# EAGLE schematic Wave X Motor Drivers (EAGLE 7.3.0)
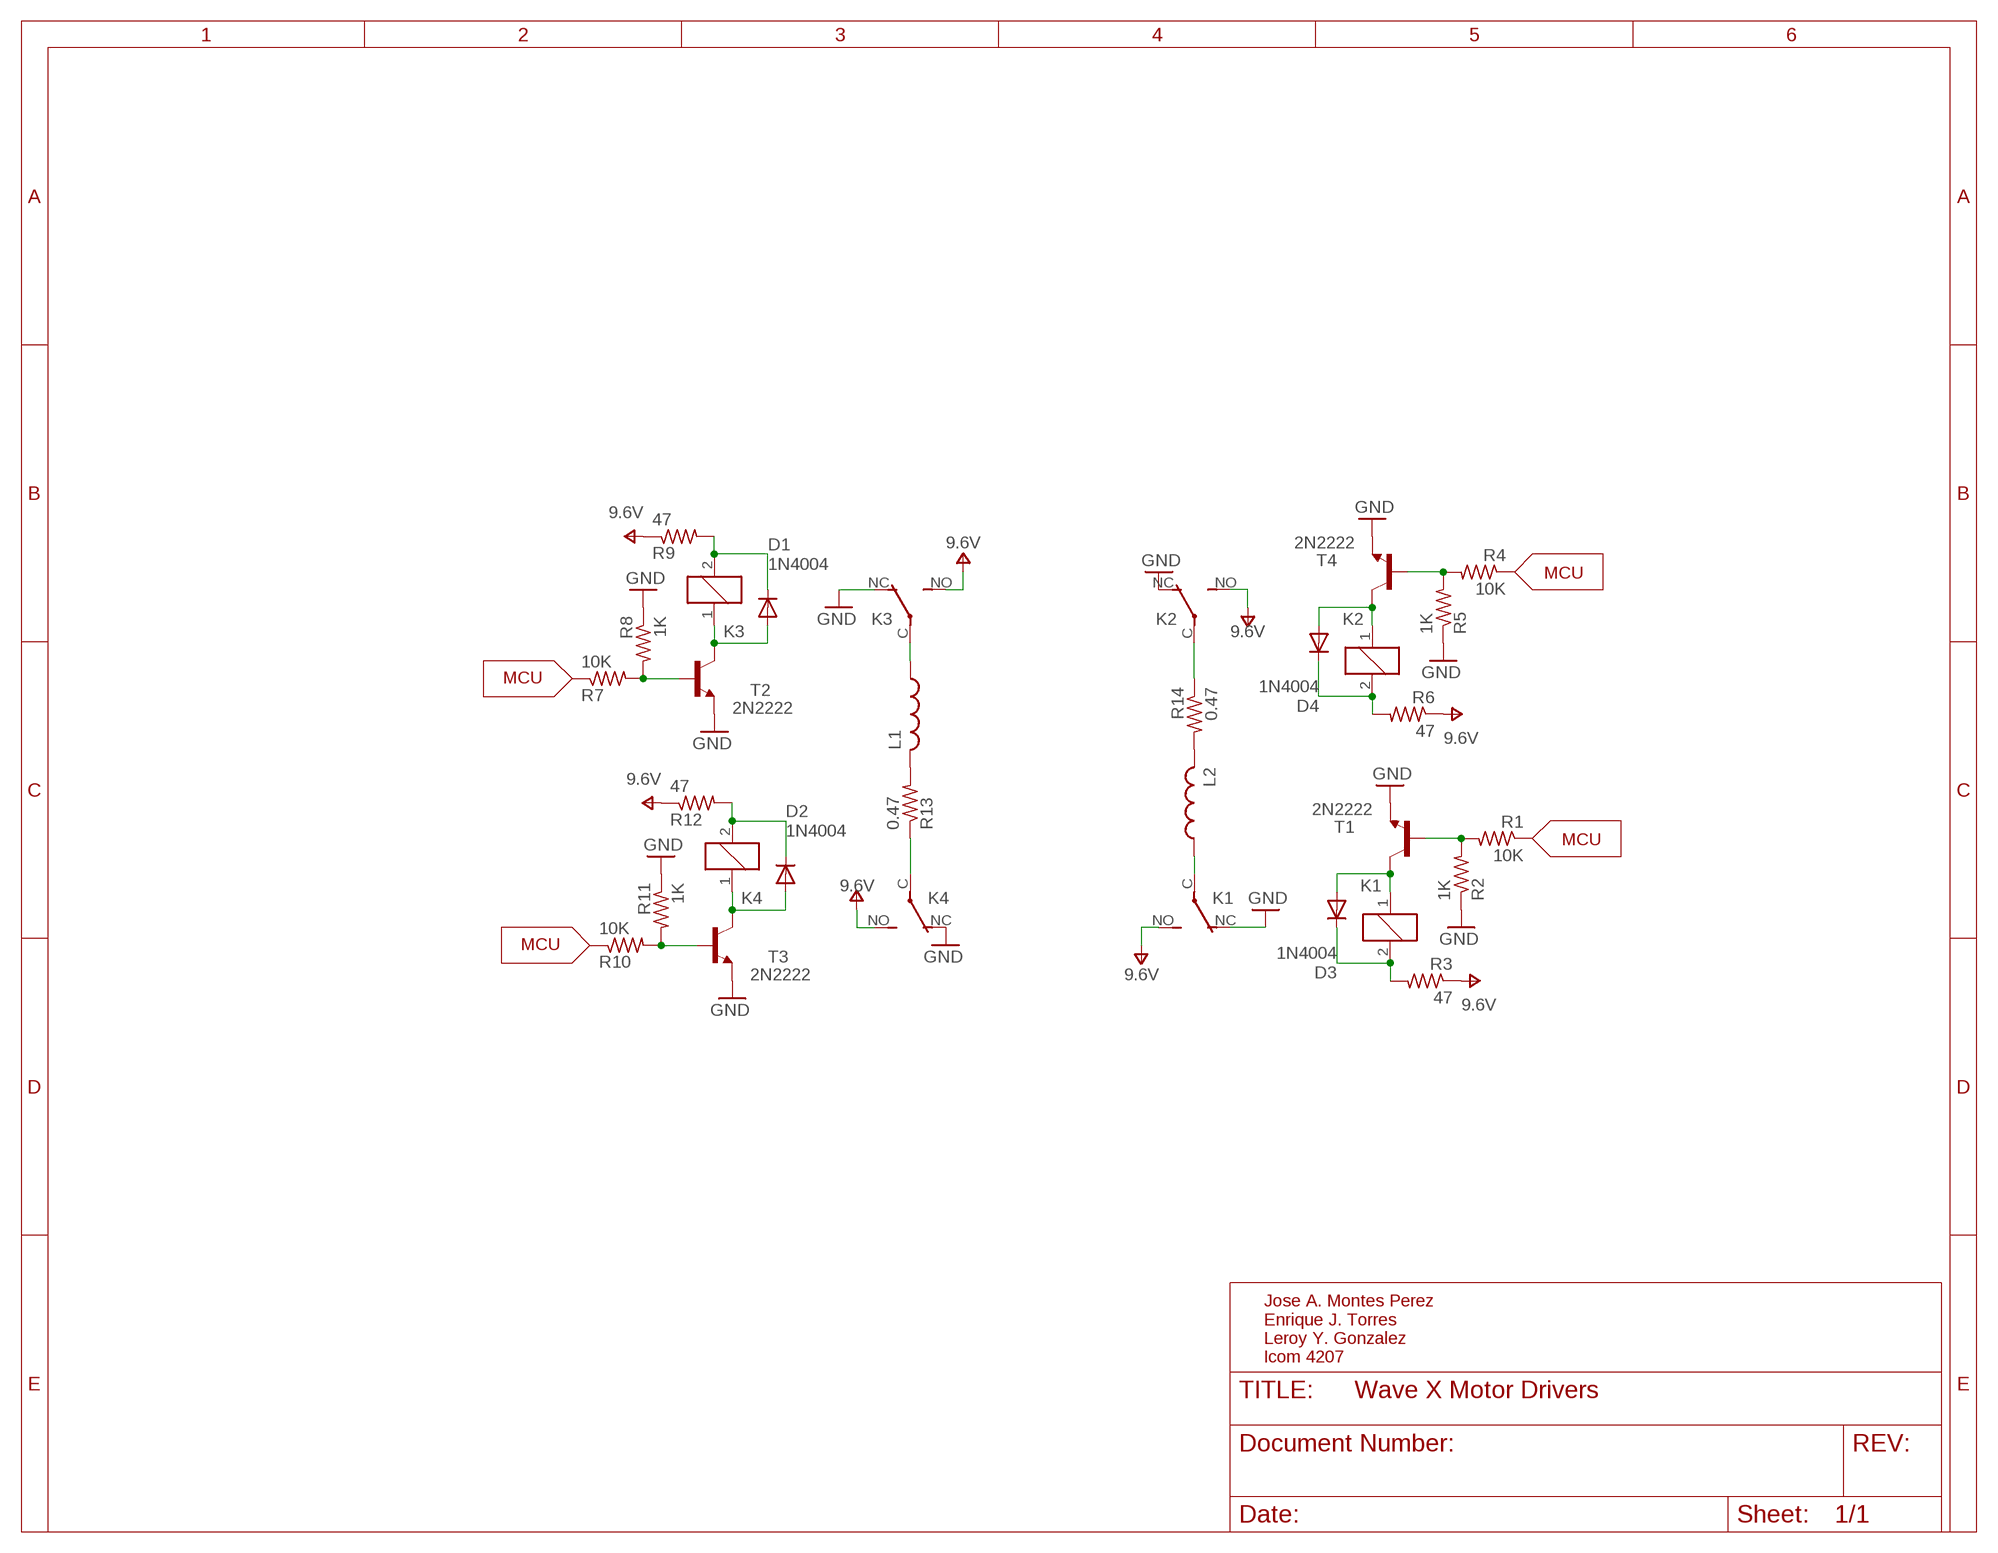
[diagram p0: schematic, sheet 1]

## Parts
D1  1N4004  [DO41-10]
D2  1N4004  [DO41-10]
D3  1N4004  [DO41-10]
D4  1N4004  [DO41-10]
K1  JJM1-12V  [JJM1C]
K2  JJM1-12V  [JJM1C]
K3  JJM1-12V  [JJM1C]
K4  JJM1-12V  [JJM1C]
L1  L-USL4532P  [L4532P]
L2  L-USL4532P  [L4532P]
R1  10K  R-US_0207/7  [0207/7]
R2  1K  R-US_0207/7  [0207/7]
R3  47  R-US_0207/7  [0207/7]
R4  10K  R-US_0207/7  [0207/7]
R5  1K  R-US_0207/7  [0207/7]
R6  47  R-US_0207/7  [0207/7]
R7  10K  R-US_0207/7  [0207/7]
R8  1K  R-US_0207/7  [0207/7]
R9  47  R-US_0207/7  [0207/7]
R10  10K  R-US_0207/7  [0207/7]
R11  1K  R-US_0207/7  [0207/7]
R12  47  R-US_0207/7  [0207/7]
R13  0.47  R-US_0207/7  [0207/7]
R14  0.47  R-US_0207/7  [0207/7]
T1  2N2222  [TO18]
T2  2N2222  [TO18]
T3  2N2222  [TO18]
T4  2N2222  [TO18]

## Nets
GND: K1.NC(2:O) K2.NC(2:O) K3.NC(2:O) K4.NC(2:O) R2.1 R5.1 R8.1 R11.1 T1.1(E) T2.1(E) T3.1(E) T4.1(E)
N$1: D3.A K1.1 T1.3(C)
N$2: R1.2 R2.2 T1.2(B)
N$3: D3.C K1.2 R3.2
N$4: D4.A K2.1 T4.3(C)
N$5: R4.2 R5.2 T4.2(B)
N$6: D4.C K2.2 R6.2
N$7: D1.A K3.1 T2.3(C)
N$8: R7.2 R8.2 T2.2(B)
N$9: D1.C K3.2 R9.2
N$10: D2.A K4.1 T3.3(C)
N$11: R10.2 R11.2 T3.2(B)
N$12: D2.C K4.2 R12.2
N$13: K3.C(2:P) L1.1
N$14: K4.C(2:P) R13.1
N$15: K1.C(2:P) L2.1
N$16: K2.C(2:P) R14.1
N$17: L1.2 R13.2
N$18: L2.2 R14.2
V+: K1.NO(2:S) K2.NO(2:S) K3.NO(2:S) K4.NO(2:S) R3.1 R6.1 R9.1 R12.1 ; supply symbol labelled 9.6V
Unconnected: R1.1 R4.1 R7.1 R10.1

## Notes on the sheet
- MCU
- MCU
- MCU
- MCU
- Jose A. Montes Perez
  Enrique J. Torres
  Leroy Y. Gonzalez
  Icom 4207

## Library data of the parts
D1-D4 = diode:1N4004: DIODE general purpose rectifier, 1 A
K1-K4 = relay:JJM1-12V: HALF-SIZE AUTOMOTIVE RELAY NAiS Source: http://www.mew-europe.com/.. en_ds_61210_0001.pdf; MF: AROMAT/ MATSUSHITA; MPN: JJM1-12V; OC_FARNELL: unknown; OC_NEWARK: 10C7318
L1 L2 = resistor:L-US: INDUCTOR, American symbol
R1-R14 = resistor:R-US_: RESISTOR, American symbol
T1-T4 = transistor:2N2222: NPN TRANSISTOR